# EasyEDA schematic EasyEDA_SCH_Elproj PCB_2023-05-11.json
TITLE: Sheet_1; REV: 1.0; Date: 2023-04-02; Sheet: 1/1; Drawn By: nilsonstine; Company: Your Company
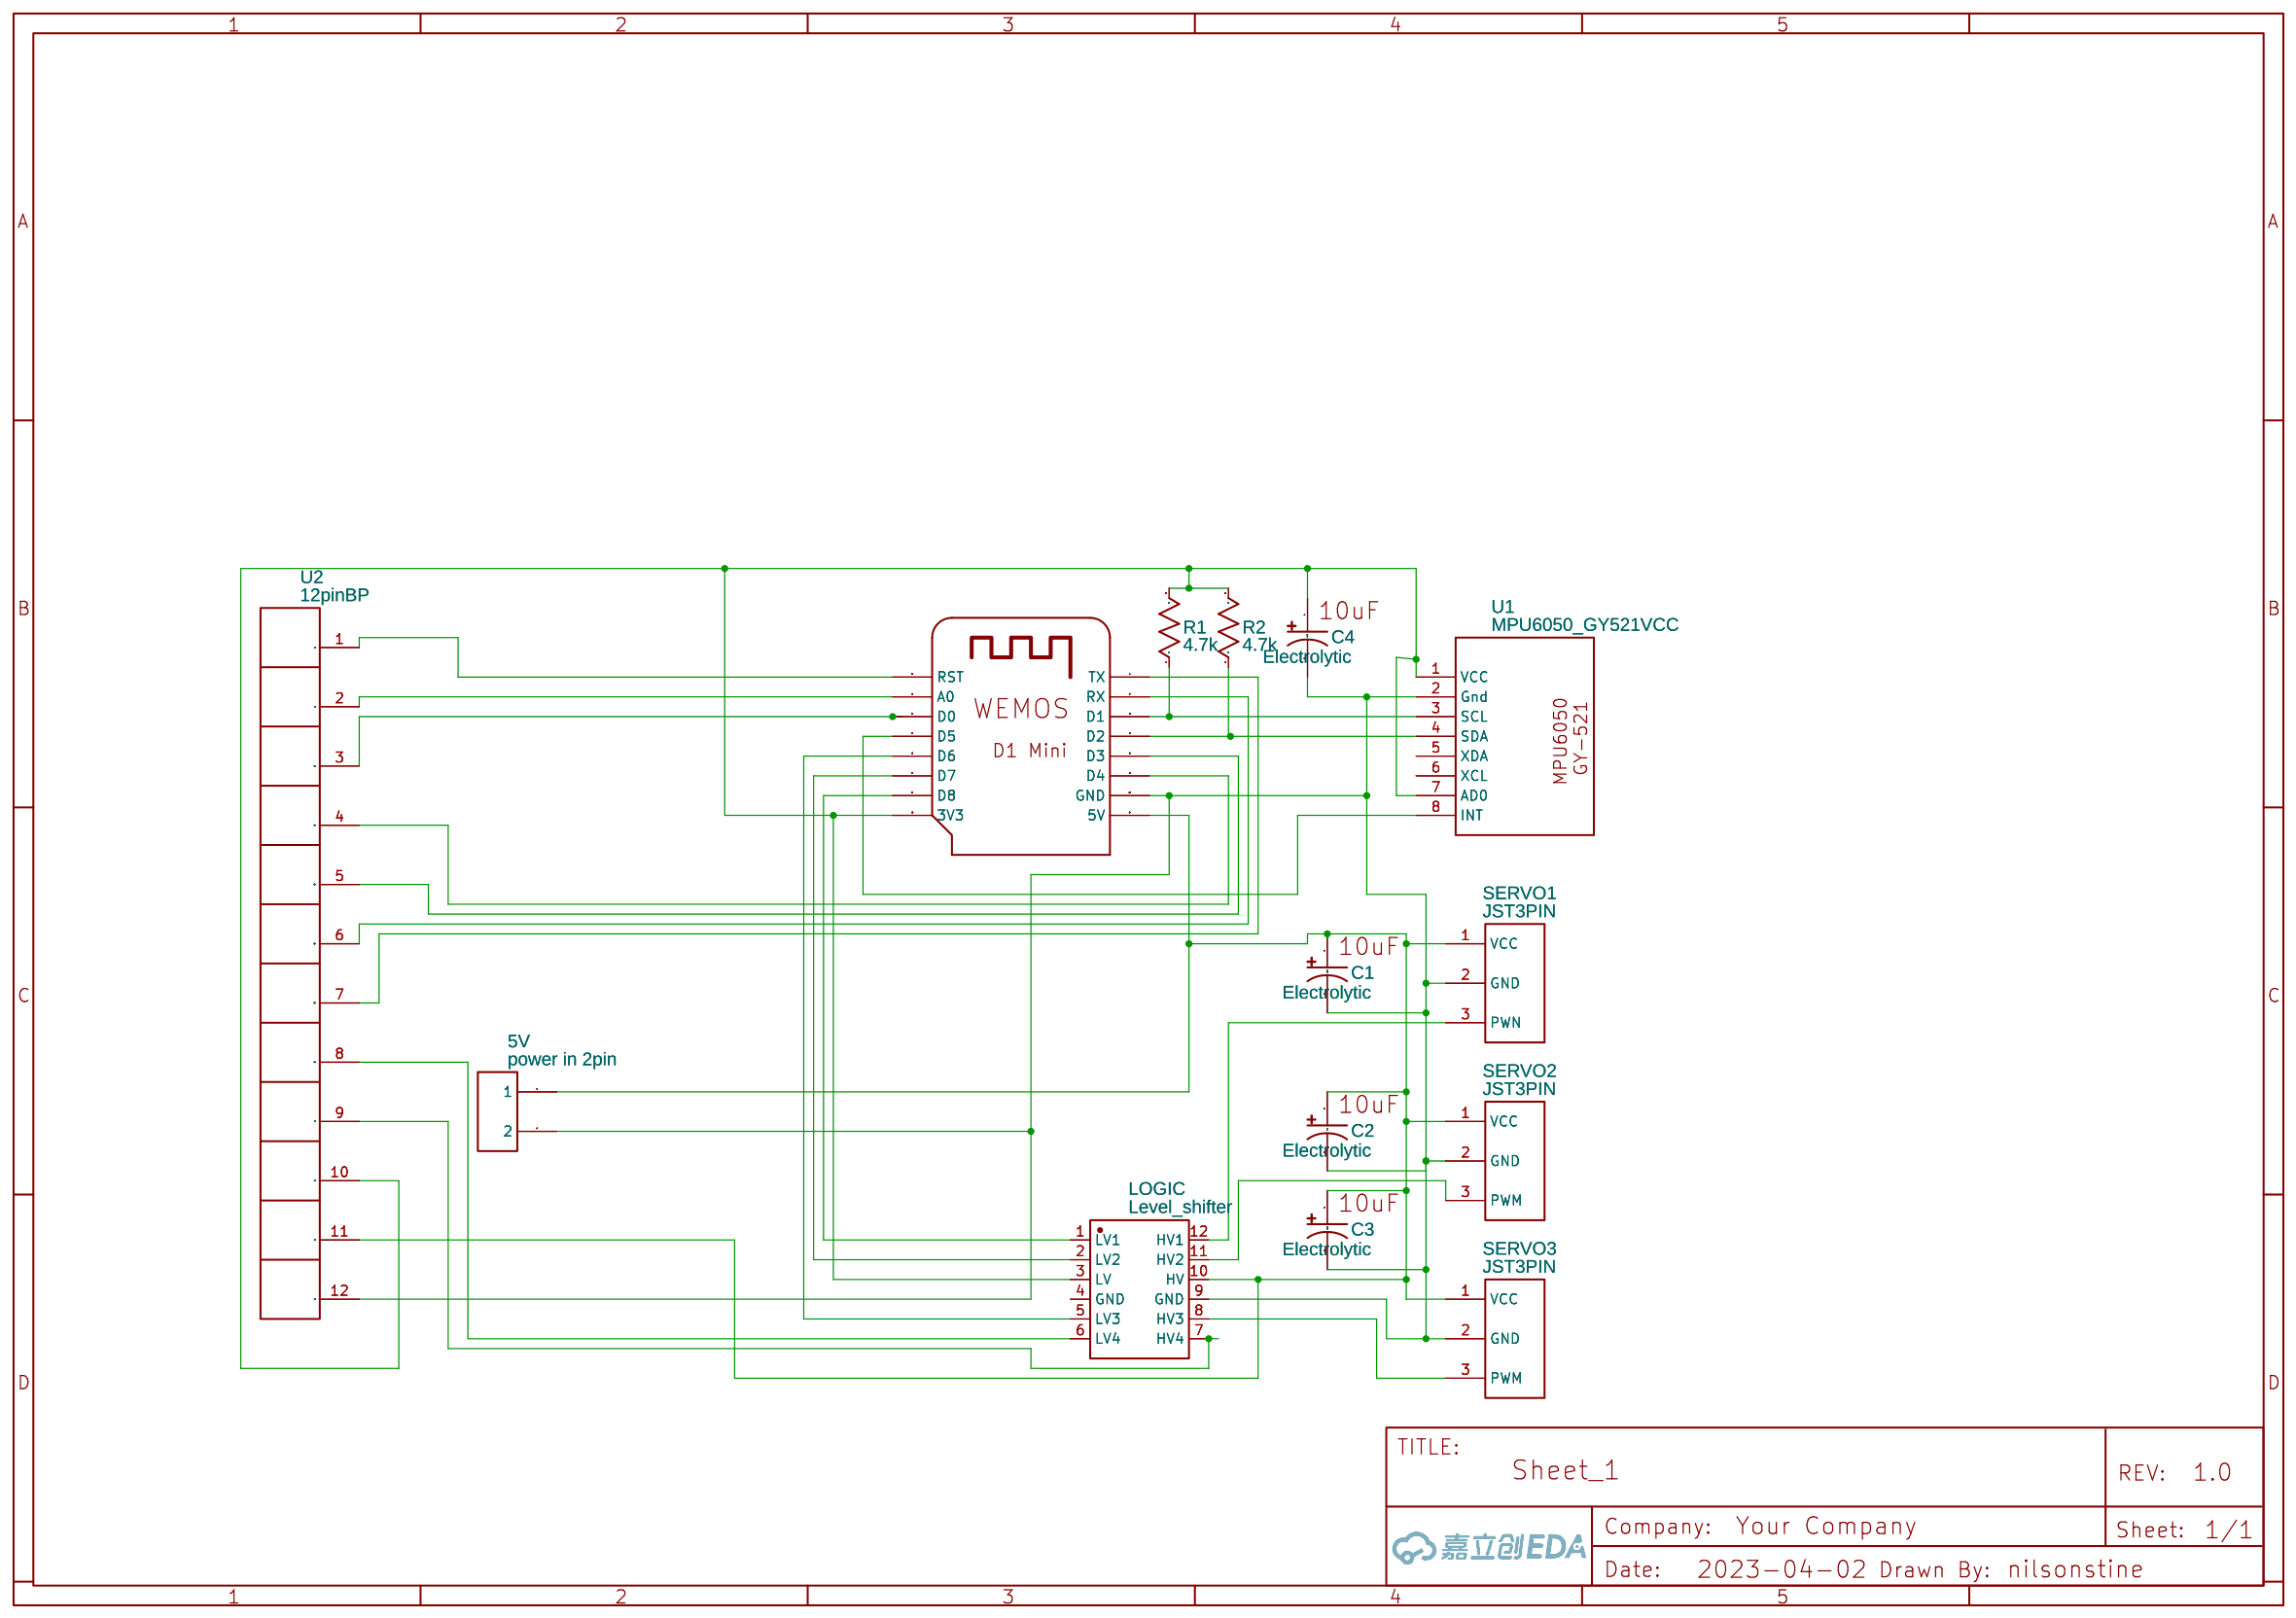
[diagram p0: schematic sheet]

## Parts
5V  power in 2pin  [NEW_FOOTPRINT TERMINAL 2 PIN]
C1  Electrolytic  [4.7UF 50V ELECTROLYTIC CAP]
C2  Electrolytic  [4.7UF 50V ELECTROLYTIC CAP]
C3  Electrolytic  [4.7UF 50V ELECTROLYTIC CAP]
C4  Electrolytic  [4.7UF 50V ELECTROLYTIC CAP]
LOGIC  Level_shifter  [LEVELSHIFTER4-SLS]
R1  4.7k  [RESISTOR 10MM -2]
R2  4.7k  [RESISTOR 10MM -2]
SERVO1  JST3PIN  [JST XH 3 PIN]
SERVO2  JST3PIN  [JST XH 3 PIN]
SERVO3  JST3PIN  [JST XH 3 PIN]
U1  MPU6050_GY521VCC  [MPU6050 GY521]
U2  12pinBP  [12P]
WEMOSU3  WEMOS D1 Mini  [WEMOS_MY]

## Library data of the parts
5V = terminal2pin: catid: 20; Contributor: Арам Хачатурян; Supplier: 1; sim: true; Package Display: No
C1-C4 = CAPACITOR_ELECTROLYTIC_US_10UF: Supplier: YUJING; Contributor: EasyEDA; Capacitance: 10u; sim: true; Package Display: No
LOGIC = Level_shifter: catid: 20; Contributor: pkr7098; sim: true; Package Display: No
R1 R2 = R_0603_US: Contributor: LCEDA_Lib; Package Display: No
SERVO1-SERVO3 = JST3PIN: catid: 20; Contributor: mooham; sim: true; Package Display: No
U1 = MPU6050_GY521VCC: Contributor: Rachna Sangwan; sim: true; Package Display: No
U2 = 12pinBP: catid: 20; Contributor: KIrill_1; sim: true; Package Display: No
WEMOSU3 = -: Package Display: No

## Nets
Net-(5V-1): 5V.1 C1.1 C2.1 C3.1 LOGIC.10(HV) SERVO1.1(VCC) SERVO2.1(VCC) SERVO3.1(VCC) U2.11(+5V) WEMOSU3.5V
Net-(5V-2): 5V.2 C1.2 C2.2 C3.2 C4.2 LOGIC.9(GND) SERVO1.2(GND) SERVO2.2(GND) SERVO3.2(GND) U1.2(Gnd) U2.12(+5V) WEMOSU3.GND
Net-(C4-1): C4.1 LOGIC.3(LV) R1.2 R2.2 U1.1(VCC) U1.7(AD0) U2.10(+5V) WEMOSU3.3V3
Net-(LOGIC-1): LOGIC.1(LV1) WEMOSU3.D8
Net-(LOGIC-2): LOGIC.2(LV2) WEMOSU3.D7
Net-(LOGIC-5): LOGIC.5(LV3) WEMOSU3.D6
Net-(LOGIC-6): LOGIC.6(LV4) U2.8(COM)
Net-(LOGIC-7): LOGIC.7(HV4) U2.9
Net-(LOGIC-8): LOGIC.8(HV3) SERVO3.3(PWM)
Net-(LOGIC-11): LOGIC.11(HV2) SERVO2.3(PWM)
Net-(LOGIC-12): LOGIC.12(HV1) SERVO1.3(PWN)
Net-(R1-1): R1.1 U1.3(SCL) WEMOSU3.D1
Net-(R2-1): R2.1 U1.4(SDA) WEMOSU3.D2
Net-(U1-8): U1.8(INT) WEMOSU3.D5
Net-(U2-1): U2.1(PG) WEMOSU3.RST
Net-(U2-2): U2.2 WEMOSU3.A0
Net-(U2-3): U2.3(+12V) WEMOSU3.D0
Net-(U2-4): U2.4(-12V) WEMOSU3.D4
Net-(U2-5): U2.5(COM) WEMOSU3.D3
Net-(U2-6): U2.6(COM) WEMOSU3.RX
Net-(U2-7): U2.7(COM) WEMOSU3.TX

Not connected (* = marked no-connect by the designer): LOGIC 4(GND); U1 5(XDA) 6(XCL)
